# EAGLE design lumysens (EAGLE 8.6.1)
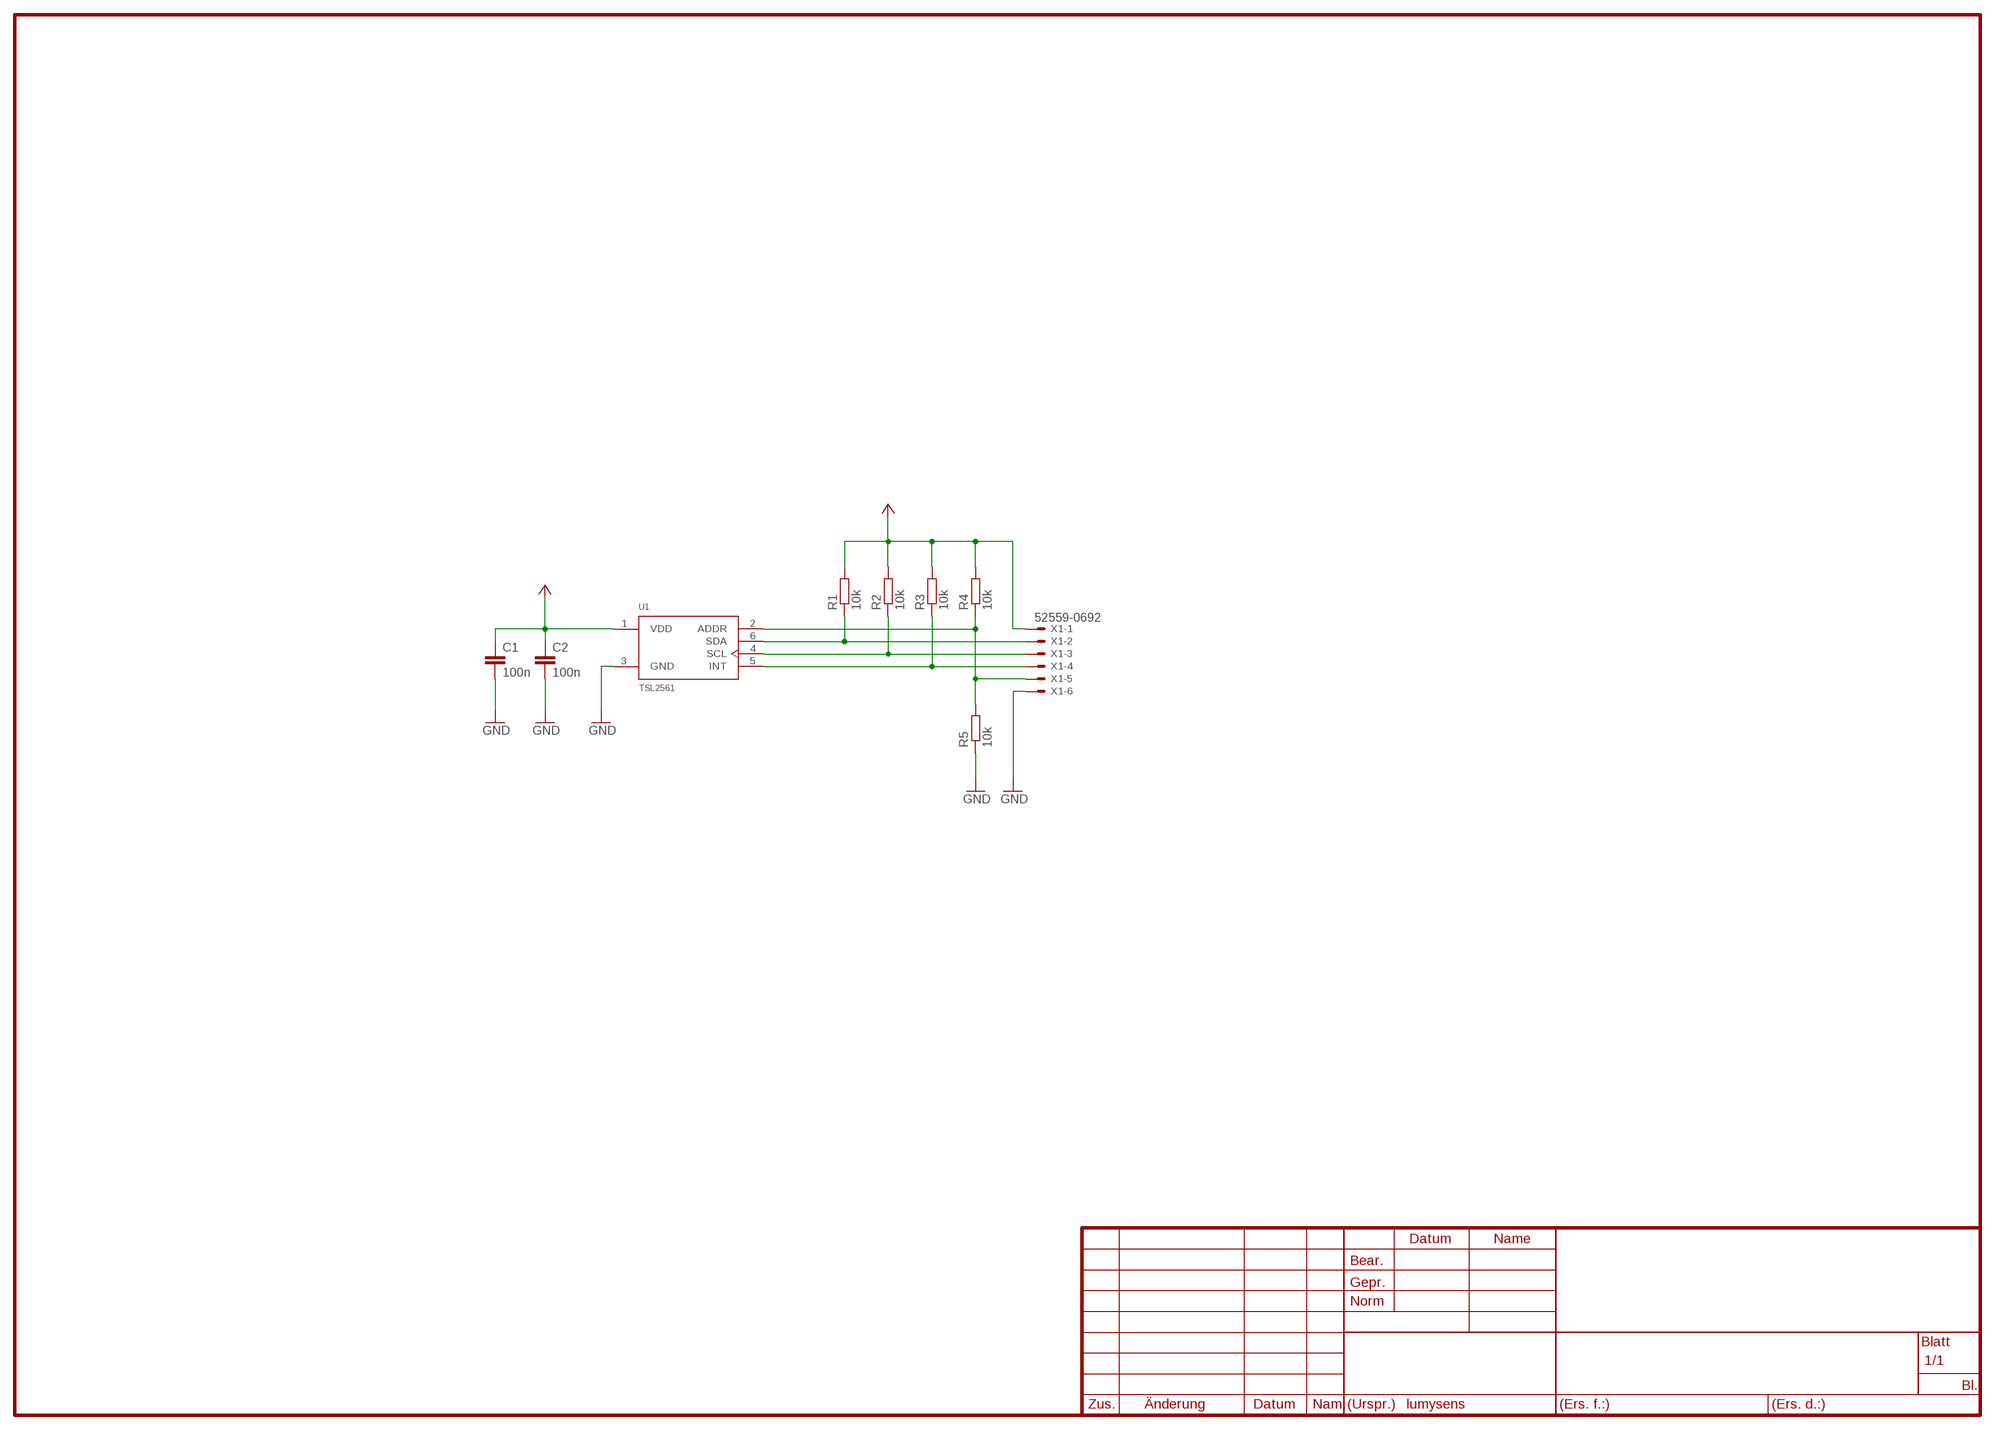
[diagram p0: schematic, sheet 1]

## Parts
C1  100n  C-EUC0603  [C0603]
C2  100n  C-EUC0603  [C0603]
R1  10k  R-EU_R0603  [R0603]
R2  10k  R-EU_R0603  [R0603]
R3  10k  R-EU_R0603  [R0603]
R4  10k  R-EU_R0603  [R0603]
R5  10k  R-EU_R0603  [R0603]
U1  TSL2561  [TMB-6]
X1  52559-0692  [52559-0692]

## Nets
+3V3: C1.1 C2.1 R1.2 R2.2 R3.2 R4.2 U1.1(VDD) X1.1 ; supply symbol labelled VCC
GND: C1.2 C2.2 R5.1 U1.3(GND) X1.6
N$5: R4.1 R5.2 U1.2(ADDR) X1.5
N$7: R1.1 U1.6(SDA) X1.2
N$8: R2.1 U1.4(SCL) X1.3
N$9: R3.1 U1.5(INT) X1.4

## Library data of the parts
C1 C2 = rcl:C-EU: CAPACITOR, European symbol
R1-R5 = rcl:R-EU_: RESISTOR, European symbol
U1 = eagle-library-edeca.net-v5:TSL256*: Texas Instruments TSL2560 (SMBus), TSL2561 (I2C) Light-to-digital converter; INTERFACE: I2C
X1 = con-molex:52559-0692: FFC/FPC-to-Board 0.50mm (.020") SMT, Vertical, ZIF Receptacle Source: http://www.molex.com/product/ffc/52559.html; MPN: 52559-0692; OC_FARNELL: unknown; OC_NEWARK: 92M6167

## Board
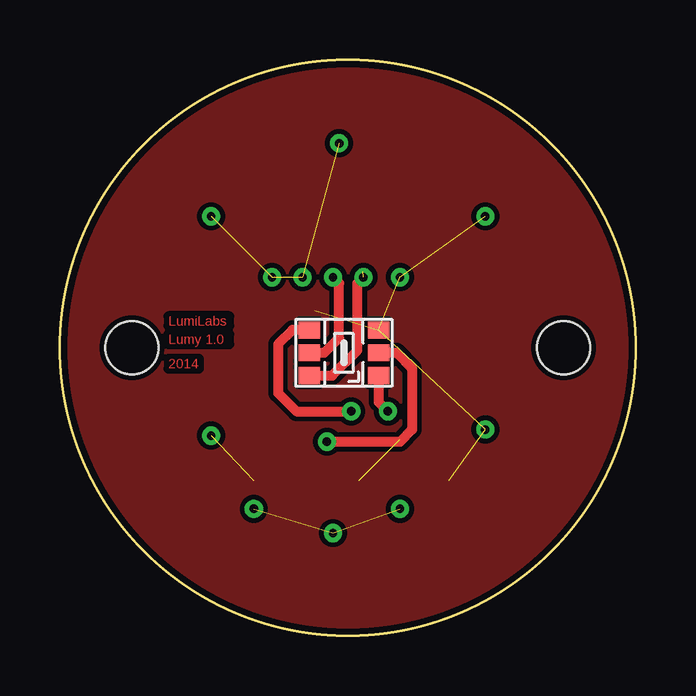
[diagram p1: board, top side]
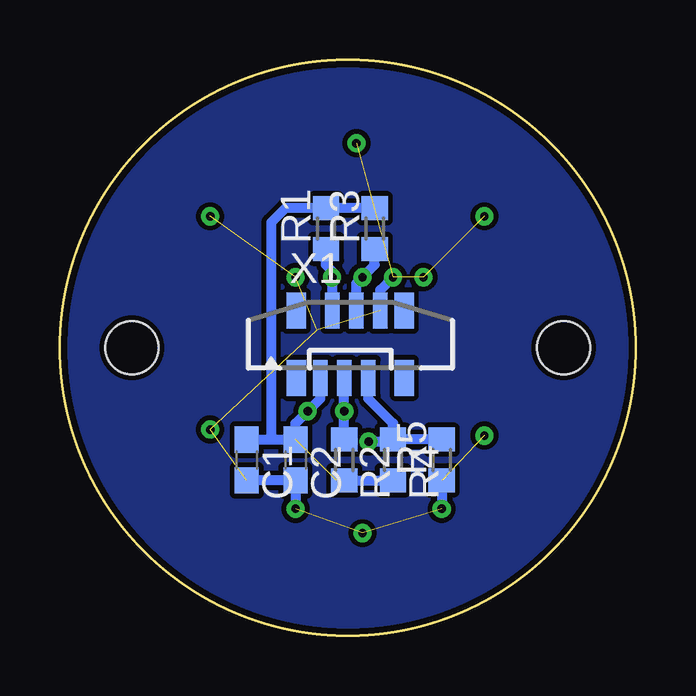
[diagram p2: board, bottom side, seen from below]

Size 24 x 24 mm. Coordinates in mm from the lower left corner, seen from the top.
Outline: circle at 12,12 radius 12
Copper layers (1*16): Top 0.035mm / dielectric 1.5mm / Bottom 0.035mm
Design rules "default": minimum track width 10mil, minimum drill 10mil, track to track 8mil, track to pad 8mil, pad to pad 8mil, via to via 8mil, smd to smd 8mil, copper to edge 10mil, drill to drill 8mil, minimum pad ring 10mil, minimum via ring 8mil, stop-mask expansion 4mil, vias tented up to drill 0mil, thermal gap 10mil
Holes 2.2 mm at 21,12 3,12
tRestrict: area 9.9,33.2 to 14.2,35.8

### Footprints (pad centres in the part's own frame; a part is rotated, then mirrored left to right if it is on the bottom)
C0603 = smd 1.1 x 1: 1 -0.85,0; 2 0.85,0
R0603 = smd 1 x 1.1: 1 -0.85,0; 2 0.85,0
TMB-6 = smd 0.9 x 0.7: 1 -1.45,0.95; 2 -1.45,0; 3 -1.45,-0.95; 4 1.45,-0.95; 5 1.45,0; 6 1.45,0.95
52559-0692 = smd 0.6 x 1.5: 1 -1.25,-1.4; 2 -0.75,1.4; 3 -0.25,-1.4; 4 0.25,1.4; 5 0.75,-1.4; 6 1.25,1.4 | smd 0.8 x 1.5: M1 -2.25,-1.4; M2 2.25,-1.4; M3 2.25,1.4; M4 -2.25,1.4

### Placement (x,y rotation side)
C1  16.21,7.32 270 bottom
C2  14.18,7.32 270 bottom
R1  12.91,16.97 90 bottom
R2  12.15,7.32 270 bottom
R3  10.88,16.97 90 bottom
R4  10.11,7.32 270 bottom
R5  8.08,7.32 90 bottom
U1  11.84,11.79 180 top
X1  11.89,12.15 0 bottom

### Tracks (layer width: path | path; a pad name or v marks a point on that pad's centre or on a via)
+3V3  (via drill 0.35)  (1 unrouted)
  Top 0.406: U1.1 13.29,9.73 v13.67,9.35
  Bottom 0.406: C1.1 15.19,8.17 | 15.19,8.17 C2.1 14.18,8.84 v13.67,9.35 13.14,9.88 X1.1 | 12.48,6.47 R2.2 R4.2 | R3.2 R1.2 14.6,17.82 15.19,17.23 15.19,8.17
GND  (via drill 0.35)  (11 unrouted)
  Bottom 0.406: C1.2 C2.2 v14.18,5.29 | X1.6 10.64,14.41 v10.11,14.94 | R5.1 v8.08,5.29
  other vias: 8.84,14.94 14.18,14.94 11.64,20.53 11.38,4.27 17.73,8.59 6.3,8.34 6.3,17.48 17.73,17.48
N$1
  pour Top: 11.89,23.83 arc90 0.21,12.15 0.21,11.89 arc90 11.89,0.21 12.15,0.21 arc90 23.83,11.89 23.83,12.15 arc90 12.15,23.83
  pour Bottom: 11.89,23.83 arc90 0.21,12.15 0.21,11.89 arc90 11.89,0.21 12.15,0.21 arc90 23.83,11.89 23.83,12.15 arc90 12.15,23.83
N$5  (via drill 0.35)
  Top 0.406: U1.2 14.02,11.79 14.69,11.13 14.69,8.59 14.18,8.08 v11.13,8.08
  Bottom 0.406: R5.2 R4.1 | X1.5 11.14,9.87 10.11,8.84 R4.1 | R4.1 10.2,8.08 v11.13,8.08
N$7  (via drill 0.35)  (1 unrouted)
  Top 0.406: U1.6 11.35,10.84 12.4,11.89 12.4,14.69 v12.65,14.94
  Bottom 0.406: X1.2 12.64,15.18 12.91,15.45 R1.1
N$8  (via drill 0.35)
  Top 0.406: U1.4 9.69,12.74 9.1,12.15 9.1,10.11 9.86,9.35 v12.15,9.35
  Bottom 0.406: X1.3 v12.15,9.35 R2.1
N$9  (via drill 0.35)
  Top 0.406: U1.5 11.03,11.79 11.64,12.4 11.64,14.69 v11.38,14.94
  Bottom 0.406: X1.4 11.64,14.68 v11.38,14.94 10.88,15.45 R3.1

### Text on the board
Top: LumiLabs | Lumy 1.0 | 2014